# Altium project UD2 CPLD.PrjPcb
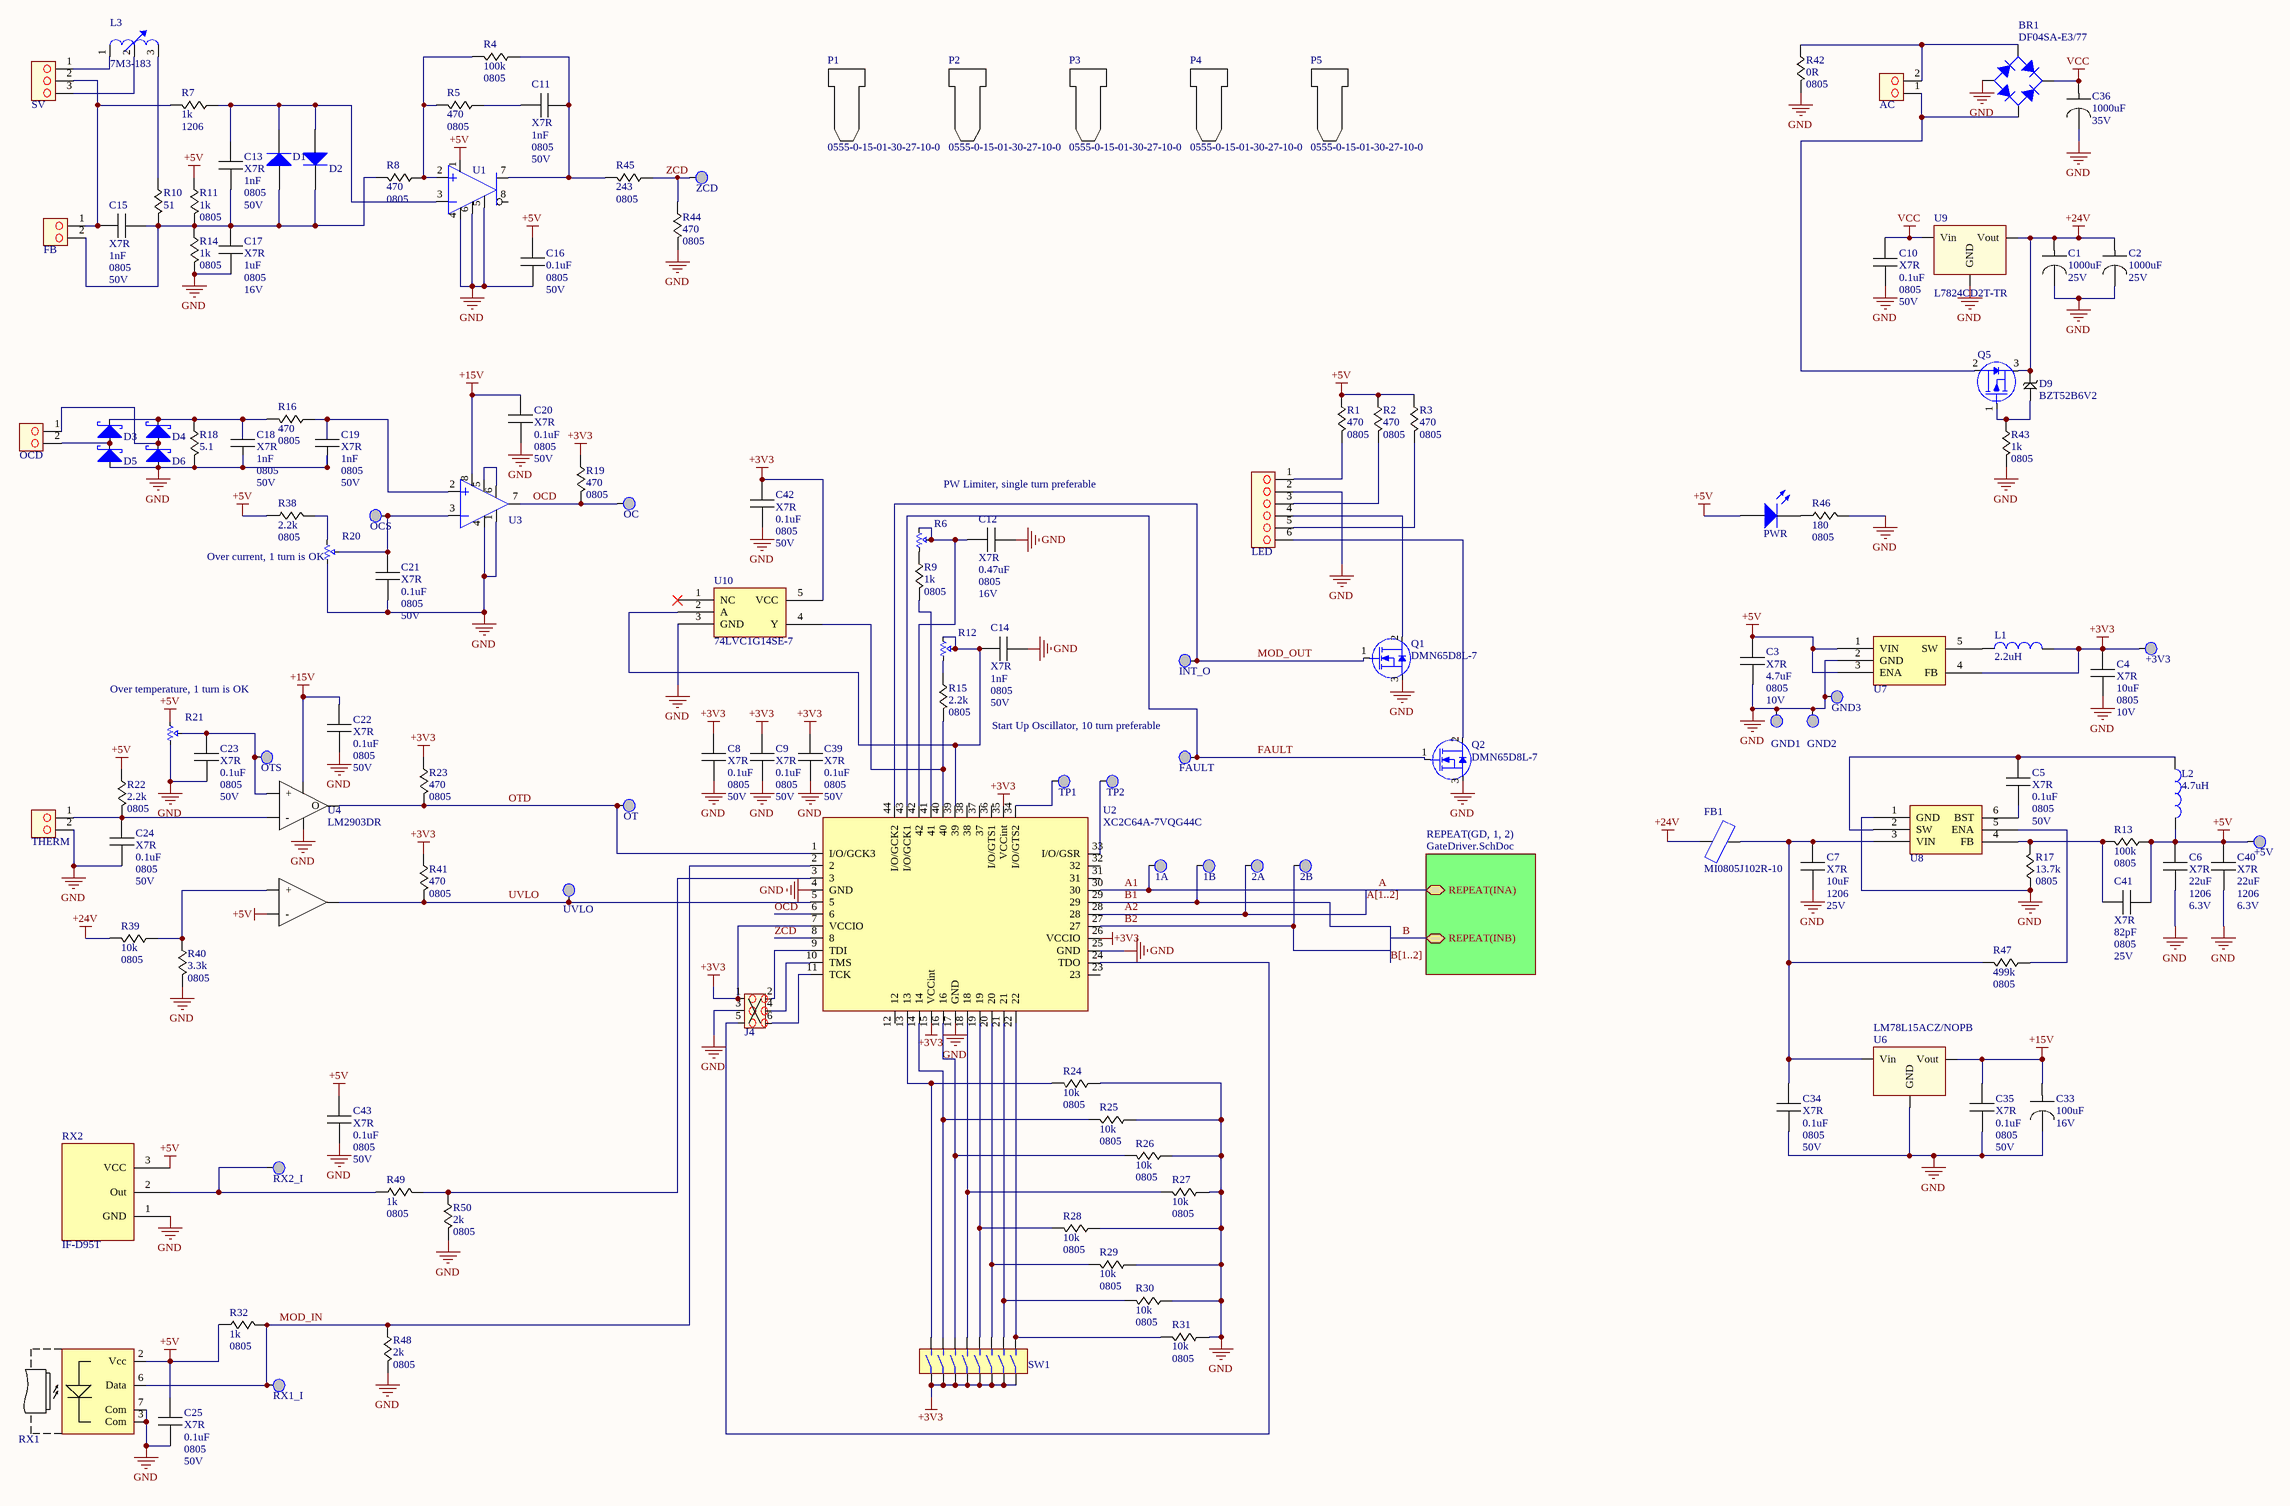
[diagram p0: UD2 CPLD.SchDoc]
2 sheets, 184 parts. Net scope: hierarchical (ports join the sheet entries above them; power ports are global).
Board file: UD2 CPLD.PcbDoc
Sheets:
  UD2 CPLD.SchDoc
    GD1 = GateDriver.SchDoc
    GD2 = GateDriver.SchDoc

## Sheet UD2 CPLD.SchDoc: UD+ CPLD
size C; Engineer: Phillip Slawinski; DocumentName: UD2CPLD

### Parts
1A  Testpoint  [Keystone5002]  (value not drawn)
1B  Testpoint  [Keystone5002]  (value not drawn)
2A  Testpoint  [Keystone5002]  (value not drawn)
2B  Testpoint  [Keystone5002]  (value not drawn)
+3V3  Testpoint  [Keystone5004]  (value not drawn)
+5V  Testpoint  [Keystone5003]  (value not drawn)
AC  22-23-2021  [22-23-2021]  (value not drawn)
BR1  DF04SA-E3/77  [DFS]
C1  Capacitance: 1000uF  Voltage: 25V  [12.5mm lytic]  (hidden comment: EEU-FM1E102)
C2  Capacitance: 1000uF  Voltage: 25V  [12.5mm lytic]  (hidden comment: EEU-FM1E102)
C3  Material: X7R  Capacitance: 4.7uF  Package: 0805  Voltage: 10V  [0805C]  (hidden comment: GRM21BR71A475KA73L)
C4  Material: X7R  Capacitance: 10uF  Package: 0805  Voltage: 10V  [0805C]  (hidden comment: GRM21BR71A106KA73L)
C5  Material: X7R  Capacitance: 0.1uF  Package: 0805  Voltage: 50V  [0805C]  (hidden comment: 08055C104JAT2A)
C6  Material: X7R  Capacitance: 22uF  Package: 1206  Voltage: 6.3V  [1206C]  (hidden comment: GRM31CR70J226KE19L)
C7  Material: X7R  Capacitance: 10uF  Package: 1206  Voltage: 25V  [1206C]  (hidden comment: GRM31CR71E106KA12L)
C8  Material: X7R  Capacitance: 0.1uF  Package: 0805  Voltage: 50V  [0805C]  (hidden comment: 08055C104JAT2A)
C9  Material: X7R  Capacitance: 0.1uF  Package: 0805  Voltage: 50V  [0805C]  (hidden comment: 08055C104JAT2A)
C10  Material: X7R  Capacitance: 0.1uF  Package: 0805  Voltage: 50V  [0805C]  (hidden comment: 08055C104JAT2A)
C11  Material: X7R  Capacitance: 1nF  Package: 0805  Voltage: 50V  [0805C]  (hidden comment: C0805C102K5RACTU)
C12  Material: X7R  Capacitance: 0.47uF  Package: 0805  Voltage: 16V  [0805C]  (hidden comment: 0805YC474KAT2A)
C13  Material: X7R  Capacitance: 1nF  Package: 0805  Voltage: 50V  [0805C]  (hidden comment: C0805C102K5RACTU)
C14  Material: X7R  Capacitance: 1nF  Package: 0805  Voltage: 50V  [0805C]  (hidden comment: C0805C102K5RACTU)
C15  Material: X7R  Capacitance: 1nF  Package: 0805  Voltage: 50V  [0805C]  (hidden comment: C0805C102K5RACTU)
C16  Capacitance: 0.1uF  Package: 0805  Voltage: 50V  [0805C]  (hidden comment: 08055C104JAT2A)
C17  Material: X7R  Capacitance: 1uF  Package: 0805  Voltage: 16V  [0805C]  (hidden comment: CC0805KKX7R7BB105)
C18  Material: X7R  Capacitance: 1nF  Package: 0805  Voltage: 50V  [0805C]  (hidden comment: C0805C102K5RACTU)
C19  Material: X7R  Capacitance: 1nF  Package: 0805  Voltage: 50V  [0805C]  (hidden comment: C0805C102K5RACTU)
C20  Material: X7R  Capacitance: 0.1uF  Package: 0805  Voltage: 50V  [0805C]  (hidden comment: 08055C104JAT2A)
C21  Material: X7R  Capacitance: 0.1uF  Package: 0805  Voltage: 50V  [0805C]  (hidden comment: 08055C104JAT2A)
C22  Material: X7R  Capacitance: 0.1uF  Package: 0805  Voltage: 50V  [0805C]  (hidden comment: 08055C104JAT2A)
C23  Material: X7R  Capacitance: 0.1uF  Package: 0805  Voltage: 50V  [0805C]  (hidden comment: 08055C104JAT2A)
C24  Material: X7R  Capacitance: 0.1uF  Package: 0805  Voltage: 50V  [0805C]  (hidden comment: 08055C104JAT2A)
C25  Material: X7R  Capacitance: 0.1uF  Package: 0805  Voltage: 50V  [0805C]  (hidden comment: 08055C104JAT2A)
C33  Capacitance: 100uF  Voltage: 16V  [6.3MM LYTIC]  (hidden comment: SEK101M025AT)
C34  Material: X7R  Capacitance: 0.1uF  Package: 0805  Voltage: 50V  [0805C]  (hidden comment: 08055C104JAT2A)
C35  Material: X7R  Capacitance: 0.1uF  Package: 0805  Voltage: 50V  [0805C]  (hidden comment: 08055C104JAT2A)
C36  Capacitance: 1000uF  Voltage: 35V  [12.5mm lytic]  (hidden comment: UVR1V102MHD)
C39  Material: X7R  Capacitance: 0.1uF  Package: 0805  Voltage: 50V  [0805C]  (hidden comment: 08055C104JAT2A)
C40  Material: X7R  Capacitance: 22uF  Package: 1206  Voltage: 6.3V  [1206C]  (hidden comment: GRM31CR70J226KE19L)
C41  Material: X7R  Capacitance: 82pF  Package: 0805  Voltage: 25V  [0805C]  (hidden comment: CC0805JRNPO9BN820)
C42  Material: X7R  Capacitance: 0.1uF  Package: 0805  Voltage: 50V  [0805C]  (hidden comment: 08055C104JAT2A)
C43  Material: X7R  Capacitance: 0.1uF  Package: 0805  Voltage: 50V  [0805C]  (hidden comment: 08055C104JAT2A)
D1  MCL4148-TR  [MicroMELF]  (value not drawn)
D2  MCL4148-TR  [MicroMELF]  (value not drawn)
D3  MBR0530  [SOD-123]  (value not drawn)
D4  MBR0530  [SOD-123]  (value not drawn)
D5  MBR0530  [SOD-123]  (value not drawn)
D6  MBR0530  [SOD-123]  (value not drawn)
D9  BZT52B6V2  [SOD-123]
FAULT  Testpoint  [Keystone5002]  (value not drawn)
FB  22-23-2021  [22-23-2021]  (value not drawn)
FB1  MI0805J102R-10  [0805FB]
GND1  Testpoint  [Keystone5001]  (value not drawn)
GND2  Testpoint  [Keystone5001]  (value not drawn)
GND3  Testpoint  [Keystone5001]  (value not drawn)
INT_O  Testpoint  [Keystone5002]  (value not drawn)
J4  67996-406HLF  [2X3 Pin Header]  (value not drawn)
L1  Inductance: 2.2uH  [1210L]  (hidden comment: BRL3225T2R2M)
L2  Inductance: 4.7uH  [SRN4012T]  (hidden comment: SRN4012TA-4R7M)
L3  7M3-183  [Slot Ten]
LED  22-23-2061  [22-23-2061]  (value not drawn)
OC  Testpoint  [Keystone5002]  (value not drawn)
OCD  22-23-2021  [22-23-2021]  (value not drawn)
OCS  Testpoint  [Keystone5002]  (value not drawn)
OT  Testpoint  [Keystone5002]  (value not drawn)
OTS  Testpoint  [Keystone5002]  (value not drawn)
P1  0555-0-15-01-30-27-10-0  (mechanical)
P2  0555-0-15-01-30-27-10-0  (mechanical)
P3  0555-0-15-01-30-27-10-0  (mechanical)
P4  0555-0-15-01-30-27-10-0  (mechanical)
P5  0555-0-15-01-30-27-10-0  (mechanical)
PWR  150080GS75000  [0805LED]  (value not drawn)
Q1  DMN65D8L-7  [SOT23-3]
Q2  DMN65D8L-7  [SOT23-3]
Q5  DMP2035U-7  [SOT23-3]  (value not drawn)
R1  Resistance: 470  Package: 0805  [0805R]  (hidden comment: RC0805FR-07470RL)
R2  Resistance: 470  Package: 0805  [0805R]  (hidden comment: RC0805FR-07470RL)
R3  Resistance: 470  Package: 0805  [0805R]  (hidden comment: RC0805FR-07470RL)
R4  Resistance: 100k  Package: 0805  [0805R]  (hidden comment: RC0805FR-07100KL)
R5  Resistance: 470  Package: 0805  [0805R]  (hidden comment: RC0805FR-07470RL)
R6  TC33X-2-103E  [3mmTrimmer]  (value not drawn)
R7  Resistance: 1k  Package: 1206  [1206R]  (hidden comment: RC1206FR-071KL)
R8  Resistance: 470  Package: 0805  [0805R]  (hidden comment: RC0805FR-07470RL)
R9  Resistance: 1k  Package: 0805  [0805R]  (hidden comment: RC0805FR-071KL)
R10  Resistance: 51  [2WTHResistor]  (hidden comment: MOS2CT52R510J)
R11  Resistance: 1k  Package: 0805  [0805R]  (hidden comment: RC0805FR-071KL)
R12  T93YA103KT20  [Bourns3296]  (value not drawn)
R13  Resistance: 100k  Package: 0805  [0805R]  (hidden comment: RC0805FR-07100KL)
R14  Resistance: 1k  Package: 0805  [0805R]  (hidden comment: RC0805FR-071KL)
R15  Resistance: 2.2k  Package: 0805  [0805R]  (hidden comment: RC0805FR-072K2L)
R16  Resistance: 470  Package: 0805  [0805R]  (hidden comment: RC0805FR-07470RL)
R17  Resistance: 13.7k  Package: 0805  [0805R]  (hidden comment: RC0805FR-0713K7L)
R18  Resistance: 5.1  [0.5WTHResistor]  (hidden comment: MFR50SFTE52-5R1)
R19  Resistance: 470  Package: 0805  [0805R]  (hidden comment: RC0805FR-07470RL)
R20  TC33X-2-103E  [3mmTrimmer]  (value not drawn)
R21  TC33X-2-103E  [3mmTrimmer]  (value not drawn)
R22  Resistance: 2.2k  Package: 0805  [0805R]  (hidden comment: RC0805FR-072K2L)
R23  Resistance: 470  Package: 0805  [0805R]  (hidden comment: RC0805FR-07470RL)
R24  Resistance: 10k  Package: 0805  [0805R]  (hidden comment: RC0805FR-0710KL)
R25  Resistance: 10k  Package: 0805  [0805R]  (hidden comment: RC0805FR-0710KL)
R26  Resistance: 10k  Package: 0805  [0805R]  (hidden comment: RC0805FR-0710KL)
R27  Resistance: 10k  Package: 0805  [0805R]  (hidden comment: RC0805FR-0710KL)
R28  Resistance: 10k  Package: 0805  [0805R]  (hidden comment: RC0805FR-0710KL)
R29  Resistance: 10k  Package: 0805  [0805R]  (hidden comment: RC0805FR-0710KL)
R30  Resistance: 10k  Package: 0805  [0805R]  (hidden comment: RC0805FR-0710KL)
R31  Resistance: 10k  Package: 0805  [0805R]  (hidden comment: RC0805FR-0710KL)
R32  Resistance: 1k  Package: 0805  [0805R]  (hidden comment: RC0805FR-071KL)
R38  Resistance: 2.2k  Package: 0805  [0805R]  (hidden comment: RC0805FR-072K2L)
R39  Resistance: 10k  Package: 0805  [0805R]  (hidden comment: RC0805FR-0710KL)
R40  Resistance: 3.3k  Package: 0805  [0805R]  (hidden comment: RC0805FR-073K3L)
R41  Resistance: 470  Package: 0805  [0805R]  (hidden comment: RC0805FR-07470RL)
R42  Resistance: 0R  Package: 0805  [0805R]  (hidden comment: RC0805JR-070RL)
R43  Resistance: 1k  Package: 0805  [0805R]  (hidden comment: RC0805FR-071KL)
R44  Resistance: 470  Package: 0805  [0805R]  (hidden comment: RC0805FR-07470RL)
R45  Resistance: 243  Package: 0805  [0805R]  (hidden comment: RC0805FR-07243RL)
R46  Resistance: 180  Package: 0805  [0805R]  (hidden comment: RC0805FR-07180RL)
R47  Resistance: 499k  Package: 0805  [0805R]  (hidden comment: RC0805FR-07499KL)
R48  Resistance: 2k  Package: 0805  [0805R]  (hidden comment: RC0805FR-072KL)
R49  Resistance: 1k  Package: 0805  [0805R]  (hidden comment: RC0805FR-071KL)
R50  Resistance: 2k  Package: 0805  [0805R]  (hidden comment: RC0805FR-072KL)
RX1  OPF2412T  [OPF1412T]  (value not drawn)
RX1_I  Testpoint  [Keystone5002]  (value not drawn)
RX2  IF-D95T  [FiberRX]
RX2_I  Testpoint  [Keystone5002]  (value not drawn)
SV  4-103321-5  [Pin Header, 3 Pos]  (value not drawn)
SW1  218-8LPST  [218-8LP]  (value not drawn)
THERM  22-23-2021  [22-23-2021]  (value not drawn)
TP1  Testpoint  [Keystone5002]  (value not drawn)
TP2  Testpoint  [Keystone5002]  (value not drawn)
U1  TL3116CD  [SOIC-8]  (value not drawn)
U2  XC2C64A-7VQG44C  [TQFP44]
U3  LM311DR  [SOIC-8]  (value not drawn)
U4  LM2903DR  [SOIC-8]
U6  LM78L15ACZ/NOPB  [TO-92-SW]
U7  LM3671MFX-3.3/NOPB  [SOT23-5]  (value not drawn)
U8  TPS54202HDDCR  [SOT23-6]  (value not drawn)
U9  L7824CD2T-TR  [D2PAK alt]
U10  74LVC1G14SE-7  [SOT23-5]
UVLO  Testpoint  [Keystone5002]  (value not drawn)
ZCD  Testpoint  [Keystone5002]  (value not drawn)

### Sub-sheets
REPEAT(GD, 1, 2) = GateDriver.SchDoc: REPEAT(INA) (bidir), REPEAT(INB) (bidir)

### Nets
+3V3: +3V3.1 C4.1 C8.2 C9.2 C39.2 C42.2 J4.1 L1.2 R19.2 R23.2 R41.2 SW1.1 SW1.2 SW1.3 SW1.4 SW1.5 SW1.6 SW1.7 SW1.8 U2.7(VCCIO) U2.15(VCCint) U2.26(VCCIO) U2.35(VCCint) U7.4(FB) U10.5(VCC)
+5V: +5V.1 C3.1 C6.1 C16.2 C25.2 C40.1 C41.2 C43.2 L2.2 PWR.1(A) R1.2 R2.2 R3.2 R11.2 R13.2 R21.3 R22.2 R32.2 R38.2 RX1.2(Vcc) RX2.3(VCC) U1.1(VCC+) U4.6(-) U7.1(VIN) U7.3(ENA)
+15V: C20.2 C22.2 C33.1 C35.2 U3.8(VCC+) U4.8(Vcc) U6.1(Vout)
+24V: C1.1 C2.1 D9.K FB1.1 Q5.3(S) R39.1 U9.3(Vout)
GND: BR1.2(A) C1.2 C2.2 C3.2 C4.2 C6.2 C7.2 C8.1 C9.1 C10.2 C12.2 C14.2 C16.1 C17.1 C18.1 C19.1 C20.1 C21.1 C22.1 C23.1 C24.1 C25.1 C33.2 C34.1 C35.1 C36.2 C39.1 C40.2 C42.1 C43.1 D5.A D6.A GND1.1 GND2.1 GND3.1 J4.3 L3.0 LED.2 Q1.3(S) Q2.3(S) R14.1 R17.2 R18.1 R20.1 R21.1 R24.2 R25.2 R26.2 R27.2 R28.2 R29.2 R30.2 R31.2 R40.1 R42.1 R43.1 R44.1 R46.1 R48.1 R50.1 RX1.1 RX1.3(Com) RX1.4 RX1.5 RX1.7(Com) RX1.8 RX2.1(GND) THERM.2 U1.4(VCC-) U1.5(EN) U1.6(GND) U2.4(GND) U2.17(GND) U2.25(GND) U3.1(OUT) U3.4(VCC-) U4.4(Vss) U6.2(GND) U7.2(GND) U8.1(GND) U9.2(GND) U10.3(GND)
VCC: BR1.1(K) C10.1 C36.1 U9.1(Vin)
A: 1A.1 U2.30 ; sheet REPEAT(GD, 1, 2)/REPEAT(INA)  [also labelled A1, A11]
A12: 2A.1 U2.28  [also labelled A2]
B: sheet REPEAT(GD, 1, 2)/REPEAT(INB)
B1: 1B.1 U2.29
B2: 2B.1 U2.27
FAULT: FAULT.1 Q2.1(G) U2.43(I/O/GCK1)
MOD_IN: R32.1 R48.2 RX1.6(Data) RX1_I.1 U2.2
MOD_OUT: INT_O.1 Q1.1(G) U2.44(I/O/GCK2)
OCD: OC.1 R19.1 U2.6 U3.7(COL_OUT)
OTD: OT.1 R23.1 U2.1(I/O/GCK3) U4.1(O)
UVLO: R41.1 U2.5 U4.7(O) UVLO.1
ZCD: R44.2 R45.2 U2.8 ZCD.1
NetAC_1: AC.1 BR1.4(AC) Q5.2(D)
NetAC_2: AC.2 BR1.3(AC) R42.2
NetC5_1: C5.1 L2.1 U8.2(SW)
NetC5_2: C5.2 U8.6(BST)
NetC7_1: C7.1 C34.2 FB1.2 R47.1 U6.3(Vin) U8.3(VIN)
NetC11_1: C11.1 R5.2
NetC11_2: C11.2 R4.2 R45.1 U1.7(Q_OUT)
NetC12_1: C12.1 R6.2 R6.3 U2.42
NetC13_1: C13.1 C15.2 C17.2 D1.A D2.K FB.2 R8.1 R10.1 R11.1 R14.2
NetC13_2: C13.2 D1.K D2.A R7.2 U1.3(IN-)
NetC14_1: C14.1 R12.2 R12.3 U2.39 U10.2(A)
NetC15_1: C15.1 FB.1 R7.1 SV.2
NetC18_2: C18.2 D3.K D4.K R16.1 R18.2
NetC19_2: C19.2 R16.2 U3.2(IN+)
NetC21_2: C21.2 OCS.1 R20.2 U3.3(IN-)
NetC23_2: C23.2 OTS.1 R21.2 U4.3(+)
NetC24_2: C24.2 R22.1 THERM.1 U4.2(-)
NetC41_1: C41.1 R13.1 R17.1 U8.4(FB)
NetD3_A: D3.A D5.K OCD.2
NetD4_A: D4.A D6.K OCD.1
NetD9_A: D9.A Q5.1(G) R43.2
NetJ4_2: J4.2 U2.9(TDI)
NetJ4_4: J4.4 U2.10(TMS)
NetJ4_5: J4.5 U2.24(TDO)
NetJ4_6: J4.6 U2.11(TCK)
NetL1_1: L1.1 U7.5(SW)
NetL3_1: L3.1 SV.1
NetL3_2: L3.2 SV.3
NetL3_3: L3.3 R10.2
NetLED_1: LED.1 R1.1
NetLED_3: LED.3 R2.1
NetLED_4: LED.4 Q1.2(D)
NetLED_5: LED.5 R3.1
NetLED_6: LED.6 Q2.2(D)
NetPWR_2: PWR.2(K) R46.2
NetR4_1: R4.1 R5.1 R8.2 U1.2(IN+)
NetR6_1: R6.1 R9.2
NetR9_1: R9.1 U2.41
NetR12_1: R12.1 R15.2
NetR15_1: R15.1 U2.40 U10.4(Y)
NetR20_3: R20.3 R38.1
NetR24_1: R24.1 SW1.16 U2.13
NetR25_1: R25.1 SW1.15 U2.14
NetR26_1: R26.1 SW1.14 U2.16
NetR27_1: R27.1 SW1.13 U2.18
NetR28_1: R28.1 SW1.12 U2.19
NetR29_1: R29.1 SW1.11 U2.20
NetR30_1: R30.1 SW1.10 U2.21
NetR31_1: R31.1 SW1.9 U2.22
NetR39_2: R39.2 R40.2 U4.5(+)
NetR47_2: R47.2 U8.5(ENA)
NetR49_1: R49.1 R50.2 U2.3
NetR49_2: R49.2 RX2.2(Out) RX2_I.1
NetTP1_1: TP1.1 U2.34(I/O/GTS2)
NetTP2_1: TP2.1 U2.33(I/O/GSR)
NetU3_5: U3.5(BAL) U3.6(STRB)

Not connected (* = marked no-connect by the designer): U1 8(Q/_OUT); U2 12 23 31 32 36(I/O/GTS1) 37 38; U10 1(NC)*

### Buses and harness runs
bus A[1..2]
bus B[1..2]

### Notes on the sheet
- PW Limiter, single turn preferable
- (near R20) Over current, 1 turn is OK
- (near R21) Over temperature, 1 turn is OK
- (near FAULT) Start Up Oscillator, 10 turn preferable

### Library data of the parts
AC FB OCD THERM = 22-23-2021: CONN HEADER 2POS .100 VERT TIN; Mouser Part: 538-22-23-2021; Digikey Part: WM4200-ND
BR1 = DF04SA-E3/77: DIODE GPP 1A 400V 4SMD; Mouser Part: 625-DF04SA-E3; Digikey Part: DF04SA-E3/77GICT-ND
C1 C2 = Electrolytic Capacitor: CAP ALUM 1000UF 20% 25V RADIAL; Mouser Part: 667-EEU-FM1E102; Digikey Part: P12379-ND
C3 = Capacitor: CAP CER 4.7UF 10V X7R 0805; Tolerance: *; Mouser Part: 81-GRM21BR71A475KA73; Digikey Part: 490-6480-1-ND
C4 = Capacitor: CAP CER 10UF 10V X7R 0805; Tolerance: *; Mouser Part: 81-GRM21BR71A106KA3L; Digikey Part: 490-10516-1-ND
C5 C8-C10 C16 C20-C25 C34 C35 C39 C42 C43 = Capacitor: CAP CER 0.1UF 50V X7R 0805; Tolerance: *; Mouser Part: 581-08055C104J; Digikey Part: 478-3352-1-ND
  C16: Material: X7R
C6 C40 = Capacitor: CAP CER 22UF 6.3V X7R 1206; Tolerance: *; Mouser Part: 81-GRM31CR70J226KE9L; Digikey Part: 490-6515-1-ND
C7 = Capacitor: CAP CER 10UF 25V X7R 1206; Tolerance: *; Mouser Part: 81-GRM31CR71E106KA12; Digikey Part: 1276-1804-1-ND
C11 C13-C15 C18 C19 = Capacitor: CAP CER 1000PF 50V X7R 0805; Tolerance: *; Mouser Part: 80-C0805C102K5R; Digikey Part: 399-1147-1-ND
C12 = Capacitor: CAP CER 0.47UF 16V X7R 0805; Tolerance: *; Mouser Part: 581-080516C474K; Digikey Part: 478-1403-1-ND
C17 = Capacitor: CAP CER 1UF 16V X7R 0805; Tolerance: 10%; Mouser Part: 603-CC805KKX7R7BB105; Digikey Part: 311-1365-1-ND
C33 = Electrolytic Capacitor: CAP ALUM 100UF 20% 16V RADIAL; Mouser Part: 598-SEK101M025AT; Digikey Part: 399-6545-ND
C36 = Electrolytic Capacitor: CAP ALUM 1000UF 20% 35V RADIAL; Mouser Part: 647-UVR1V102MHD; Digikey Part: 493-1085-ND
C41 = Capacitor: CAP CER 82PF 50V NPO 0805; Tolerance: *; Mouser Part: 603-CC805JRNPO9BN820; Digikey Part: 311-1110-1-ND
D1 D2 = 1N4148: DIODE GEN 75V 150MA MICROMELF; Mouser Part: 78-MCL4148; Digikey Part: MCL4148CT-ND
D3-D6 = SchottkyDiode: DIODE SCHOTTKY 30V 500MA SOD123; Mouser Part: 512-MBR0530; Digikey Part: MBR0530CT-ND
D9 = Zener: DIODE ZENER 6.2V 500MW SOD123; Mouser Part: 821-BZT52B6V2; Digikey Part: BZT52C6V2-FDICT-ND
FB1 = FerriteBead: FERRITE BEAD 1 KOHM 0805 1LN; Mouser Part: 875-MI0805J102R-10; Digikey Part: 240-2551-1-ND
J4 = M20-9980345: CONN HEADER 6POS .100 STR TIN; Mouser Part: 649-67996-406HLF; Digikey Part: 609-3218-ND
L1 = Inductor: FIXED IND 2.2UH 1.6A 78 MOHM SMD; Mouser Part: 963-BRL3225T2R2M; Digikey Part: 587-2165-1-ND
L2 = Inductor: FIXED IND 4.7UH 1.5A 95 MOHM SMD; Mouser Part: 652-SRN4012TA-4R7M; Digikey Part: SRN4012TA-4R7MCT-ND
L3 = Slot Ten-5-09
LED = 22-23-2061: CONN HEADER 6POS .100 VERT TIN; Mouser Part: 538-22-23-2061; Digikey Part: WM4204-ND
P1-P5 = PinSocket: Digikey Part: ED5042-ND; Mouser Part: 575-055500
PWR = LED: LED GREEN CLEAR 0805 SMD; Mouser Part: 710-150080GS75000; Digikey Part: 732-4983-1-ND
Q1 Q2 = NPNFET: MOSFET N-CH 60V 310mA SOT23; Mouser Part: 621-DMN65D8L-7; Digikey Part: DMN65D8L-7DICT-ND
Q5 = PNPFET: MOSFET P-CH 20V 3.6A SOT-23; Mouser Part: 621-DMP2035U-7; Digikey Part: DMP2035U-7DICT-ND
R1-R3 R5 R8 R16 R19 R23 R41 R44 = Resistor: RES SMD 470 OHM 1% 1/8W 0805; Power: 0.125W; Tolerance: 1%; Mouser Part: 603-RC0805FR-07470RL; Digikey Part: 311-470CRCT-ND
R4 R13 = Resistor: RES SMD 100K OHM 1% 1/8W 0805; Power: 0.125W; Tolerance: 1%; Mouser Part: 603-RC0805FR-07100KL; Digikey Part: 311-100KCRCT-ND
R6 R20 R21 = Potentiometer: TRIMMER 10K OHM 0.1W SMD; Resistance: 10k; Mouser Part: 72-T93YA-10K; Digikey Part: TC33X-103ECT-ND
R7 = Resistor: RES SMD 1K OHM 1% 1/4W 1206; Power: 0.25W; Tolerance: 1%; Mouser Part: 603-RC1206FR-071KL; Digikey Part: 311-1.00KFRCT-ND
R9 R11 R14 R32 R43 R49 = Resistor: RES SMD 1K OHM 1% 1/8W 0805; Power: 0.125W; Tolerance: 1%; Mouser Part: 603-RC0805FR-071KL; Digikey Part: 311-1.00KCRCT-ND
R10 = Resistor: RES 51 OHM 2W 5% AXIAL; Power: 2W; Digikey Part: PPC51W-2CT-ND; Mouser Part: 660-MOS2CT52R510J; Tolerance: 5%
R12 = Potentiometer: TRIMMER 10K OHM 0.5W TH; Resistance: 10k; Mouser Part: 72-T93YA-10K; Digikey Part: T93YA-10K-ND
R15 R22 R38 R40 = Resistor: RES SMD 2.2K OHM 1% 1/8W 0805; Power: 0.125W; Tolerance: 1%
  R15 R22 R38: Mouser Part: 603-RC0805FR-072K2L; Digikey Part: 311-2.20KCRCT-ND
  R40: Mouser Part: 603-RC0805FR-073K3L; Digikey Part: 311-3.30KCRCT-ND
R17 = Resistor: RES SMD 13.7K OHM 1% 1/8W 0805; Power: 0.125W; Tolerance: 1%; Mouser Part: 603-RC0805FR-0713K7L; Digikey Part: 311-13.7KCRCT-ND
R18 = Resistor: RES 5.1 OHM 1/2W 5% AXIAL; Power: 0.5W; Digikey Part: 5.1H-ND; Mouser Part: 603-MFR50SFTE52-5R1; Tolerance: 5%
R24-R31 R39 = Resistor: RES SMD 10K OHM 1% 1/8W 0805; Power: 0.125W; Tolerance: 1%; Mouser Part: 603-RC0805FR-0710KL; Digikey Part: 311-10.0KCRCT-ND
R42 = Resistor: RES SMD 0.0 OHM JUMPER 1/8W 0805; Power: 0.125W; Mouser Part: 603-RC0805JR-070RL; Digikey Part: 311-0.0ARCT-ND
R45 = Resistor: RES SMD 243 OHM 1% 1/8W 0805; Power: 0.125W; Tolerance: 1%; Mouser Part: 603-RC0805FR-07243RL; Digikey Part: 311-243CRCT-ND
R46 = Resistor: RES SMD 180 OHM 1% 1/8W 0805; Power: 0.125W; Tolerance: 1%; Mouser Part: 603-RC0805FR-07180RL; Digikey Part: 311-180CRCT-ND
R47 = Resistor: RES SMD 499K OHM 1% 1/8W 0805; Power: 0.125W; Tolerance: 1%; Mouser Part: 603-RC0805FR-07499KL; Digikey Part: 311-499KCRCT-ND
R48 R50 = Resistor: RES SMD 2K OHM 1% 1/8W 0805; Power: 0.125W; Tolerance: 1%; Mouser Part: 603-RC0805FR-072KL; Digikey Part: 311-2.00KCRCT-ND
RX1 = OPF2412T: RECEIVER FIBER OPTIC 5MB ST; Mouser Part: 828-OPF2412T; Digikey Part: 365-1834-ND
RX2 = IF-D95T: DETECTOR PHOTOLOGIC TTL/CMOS; Digikey Part: FB123-ND
SV = Pin Header 3 Pos: CONN HEADER 3 POS 2.54; Mouser Part: 571-4-103321-5; Digikey Part: 732-5316-ND
SW1 = 209-8LPST: SWITCH SLIDE DIP SPST 25MA 24V; Mouser Part: 710-61300311121; Digikey Part: CT2188LPST-ND
U1 = TL3116CD: IC ULTRA-FAST COMP 8-SOIC; Digikey Part: 296-6626-5-ND; Mouser Part: 595-TL3116CD
U2 = XC2C64A: IC CPLD 64MC 6.7NS 44VQFP; Digikey Part: 122-1410-ND
U3 = LM311D: IC DIFF COMP STROBE 8-SOIC; Mouser Part: 595-LM311DR; Digikey Part: 296-1388-1-ND
U4 = TL082: IC DUAL DIFF COMP 8-SOIC; Mouser Part: 595-LM2903DR; Digikey Part: 296-1012-1-ND
U6 = L78Lxx: IC REG LDO 15V 0.1A TO92-3; Mouser Part: 926-LM78L15ACZ/NOPB; Digikey Part: LM78L15ACZ/NOPB-ND
U7 = LM3671: IC REG BUCK 3.3V 0.6A SYNC SOT23; Mouser Part: 926-LM3671MFX33NOPB; Digikey Part: LM3671MF-3.3/NOPBCT-ND
U8 = TPS54202HDDCR: Buck Switching Regulator IC Positive Adjustable 0.596V 1 Output 2A SOT-23-6 Thin, TSOT-23-6; Mouser Part: 595-TPS54202HDDCR; Digikey Part: 296-44396-1-ND
U9 = LM7824
U10 = 74LVC1G14SE-7: Inverter IC 1 Channel Schmitt Trigger SOT-353; Digikey Part: 74LVC1G14SE-7CT-ND; Mouser Part: 621-74LVC1G14SE-7
1A 1B 2A 2B +3V3 +5V FAULT GND1-GND3 INT_O OC OCS OT OTS RX1_I RX2_I TP1 TP2 UVLO ZCD = Testpoint
  1A 1B 2A 2B FAULT INT_O OC OCS OT OTS RX1_I RX2_I TP1 TP2 UVLO ZCD: Digikey Part: 36-5002-ND; Mouser Part: 534-5002
  +3V3: Digikey Part: 36-5004-ND; Mouser Part: 534-5004
  +5V: Digikey Part: 36-5003-ND; Mouser Part: 534-5003
  GND1-GND3: Digikey Part: 36-5001-ND; Mouser Part: 534-5001

## Sheet GateDriver.SchDoc
size A
Used 2 times, as channels GD1, GD2. Parts and nets are listed once, with the designators drawn on the sheet.
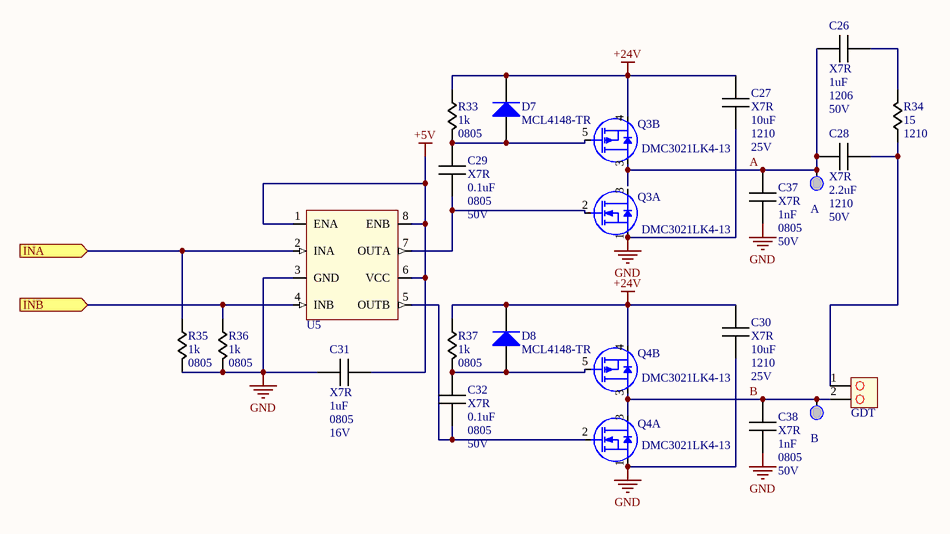
[diagram p1: GateDriver.SchDoc]

### Parts
A  Testpoint  [Keystone5002]  (value not drawn)
B  Testpoint  [Keystone5002]  (value not drawn)
C26  Material: X7R  Capacitance: 1uF  Package: 1206  Voltage: 50V  [1206C]  (hidden comment: GRM31MR71H105KA88L)
C27  Material: X7R  Capacitance: 10uF  Package: 1210  Voltage: 25V  [1210C]  (hidden comment: 885012209028)
C28  Material: X7R  Capacitance: 2.2uF  Package: 1210  Voltage: 50V  [1210C]  (hidden comment: CGA6M3X7R1H225K200AB)
C29  Material: X7R  Capacitance: 0.1uF  Package: 0805  Voltage: 50V  [0805C]  (hidden comment: 08055C104JAT2A)
C30  Material: X7R  Capacitance: 10uF  Package: 1210  Voltage: 25V  [1210C]  (hidden comment: 885012209028)
C31  Material: X7R  Capacitance: 1uF  Package: 0805  Voltage: 16V  [0805C]  (hidden comment: CC0805KKX7R7BB105)
C32  Material: X7R  Capacitance: 0.1uF  Package: 0805  Voltage: 50V  [0805C]  (hidden comment: 08055C104JAT2A)
C37  Material: X7R  Capacitance: 1nF  Package: 0805  Voltage: 50V  [0805C]  (hidden comment: C0805C102K5RACTU)
C38  Material: X7R  Capacitance: 1nF  Package: 0805  Voltage: 50V  [0805C]  (hidden comment: C0805C102K5RACTU)
D7  MCL4148-TR  [MicroMELF]
D8  MCL4148-TR  [MicroMELF]
GDT  22-23-2021  [22-23-2021]  (value not drawn)
Q3  DMC3021LK4-13  [TO-252]  (parts A,B of 2)
Q4  DMC3021LK4-13  [TO-252]  (parts A,B of 2)
R33  Resistance: 1k  Package: 0805  [0805R]  (hidden comment: RC0805FR-071KL)
R34  Resistance: 15  Package: 1210  [1210R]  (hidden comment: CRCW121015R0JNEAHP)
R35  Resistance: 1k  Package: 0805  [0805R]  (hidden comment: RC0805FR-071KL)
R36  Resistance: 1k  Package: 0805  [0805R]  (hidden comment: RC0805FR-071KL)
R37  Resistance: 1k  Package: 0805  [0805R]  (hidden comment: RC0805FR-071KL)
U5  UCC27423DR  [SOIC-8]  (value not drawn)

### Ports
INA (in), INB (in)

### Nets
+5V: C31.2 U5.1(ENA) U5.6(VCC) U5.8(ENB)
+24V: C27.1 C30.1 D7.K D8.K Q3.4(S2) Q4.4(S2) R33.2 R37.2
GND: C27.2 C30.2 C31.1 C37.1 C38.1 Q3.1(S1) Q4.1(S1) R35.1 R36.1 U5.3(GND)
A: A.1 C26.1 C28.1 C37.2 Q3.3(D1/D2)
B: B.1 C38.2 GDT.2 Q4.3(D1/D2)
INA: R35.2 U5.2(INA) ; port INA
INB: R36.2 U5.4(INB) ; port INB
NetC26_2: C26.2 R34.1
NetC28_2: C28.2 GDT.1 R34.2
NetC29_1: C29.1 Q3.2(G1) U5.7(OUTA)
NetC29_2: C29.2 D7.A Q3.5(G2) R33.1
NetC32_1: C32.1 Q4.2(G1) U5.5(OUTB)
NetC32_2: C32.2 D8.A Q4.5(G2) R37.1

### Channels
GD1: designators end in _1; ports INA=A INB=B1
GD2: designators end in _2; ports INA=A12 INB=B2

### Library data of the parts
C26 = Capacitor: CAP CER 1UF 50V X7R 1206; Tolerance: 10%; Mouser Part: 81-GRM31MR71H105KA88; Digikey Part: 490-6527-1-ND
C27 C30 = Capacitor: CAP CER 10UF 25V X7R 1210; Tolerance: *; Mouser Part: 710-885012207094; Digikey Part: 732-7729-1-ND
C28 = Capacitor: CAP ALUM 100UF 20% 16V RADIAL; Tolerance: 10%; Mouser Part: 810-CGA6M3X7R1H225K; Digikey Part: 445-5715-1-ND
C29 C32 = Capacitor: CAP CER 0.1UF 50V X7R 0805; Tolerance: *; Mouser Part: 581-08055C104J; Digikey Part: 478-3352-1-ND
C31 = Capacitor: CAP CER 1UF 16V X7R 0805; Tolerance: 10%; Mouser Part: 603-CC805KKX7R7BB105; Digikey Part: 311-1365-1-ND
C37 C38 = Capacitor: CAP CER 1000PF 50V X7R 0805; Tolerance: *; Mouser Part: 80-C0805C102K5R; Digikey Part: 399-1147-1-ND
D7 D8 = 1N4148: DIODE GEN 75V 150MA MICROMELF; Mouser Part: 78-MCL4148; Digikey Part: MCL4148CT-ND
GDT = 22-23-2021: CONN HEADER 2POS .100 VERT TIN; Mouser Part: 538-22-23-2021; Digikey Part: WM4200-ND
Q3 Q4 = FDD8424H: MOSFET N/P-CH 30V TO252-4L; Mouser Part: 512-FDD8424H; Digikey Part: FDD8424HCT-ND
R33 R35-R37 = Resistor: as R9 on sheet UD2 CPLD; Tolerance: 1%; Mouser Part: 603-RC0805FR-071KL; Digikey Part: 311-1.00KCRCT-ND
R34 = Resistor: RES SMD 15 OHM 5% 3/4W 1210; Power: 750mW; Tolerance: 5%; Mouser Part: 71-CRCW121015R0JNEAH; Digikey Part: 541-15.0DCT-ND
U5 = UCC27423D: IC DRIVER MOSFET 1.5A DUAL 8SOIC; Mouser Part: 595-UCC27423DR; Digikey Part: 296-41798-1-ND
A B = Testpoint: Digikey Part: 36-5002-ND; Mouser Part: 534-5002

## Nets that join several sheets
+5V: UD2 CPLD (25 pins), GD1 (C31_1.2 U5_1.1 U5_1.6 U5_1.8), GD2 (C31_2.2 U5_2.1 U5_2.6 U5_2.8)
+24V: UD2 CPLD (7 pins), GD1 (8 pins), GD2 (8 pins)
GND: UD2 CPLD (82 pins), GD1 (10 pins), GD2 (10 pins)
A: UD2 CPLD (1A.1 U2.30), GD1 (R35_1.2 U5_1.2)
A12: UD2 CPLD (2A.1 U2.28), GD2 (R35_2.2 U5_2.2)
B1: UD2 CPLD (1B.1 U2.29), GD1 (R36_1.2 U5_1.4)
B2: UD2 CPLD (2B.1 U2.27), GD2 (R36_2.2 U5_2.4)

## Assembly variants
DC In: not fitted 1A 1B 2A 2B +3V3 +5V A_1 A_2 B_1 B_2 BR1 C36 FAULT INT_O OC OCS OT OTS RX1_I RX2_I TP1 TP2 U9 UVLO ZCD
AC In: not fitted 1A 1B 2A 2B +3V3 +5V A_1 A_2 B_1 B_2 D9 FAULT INT_O OC OCS OT OTS Q5 R42 R43 RX1_I RX2_I TP1 TP2 UVLO ZCD